# Altium schematic sheet LIDO-HW.100.OutputStage.SchDoc
size A3; SheetNumber: 9; SheetTotal: 17
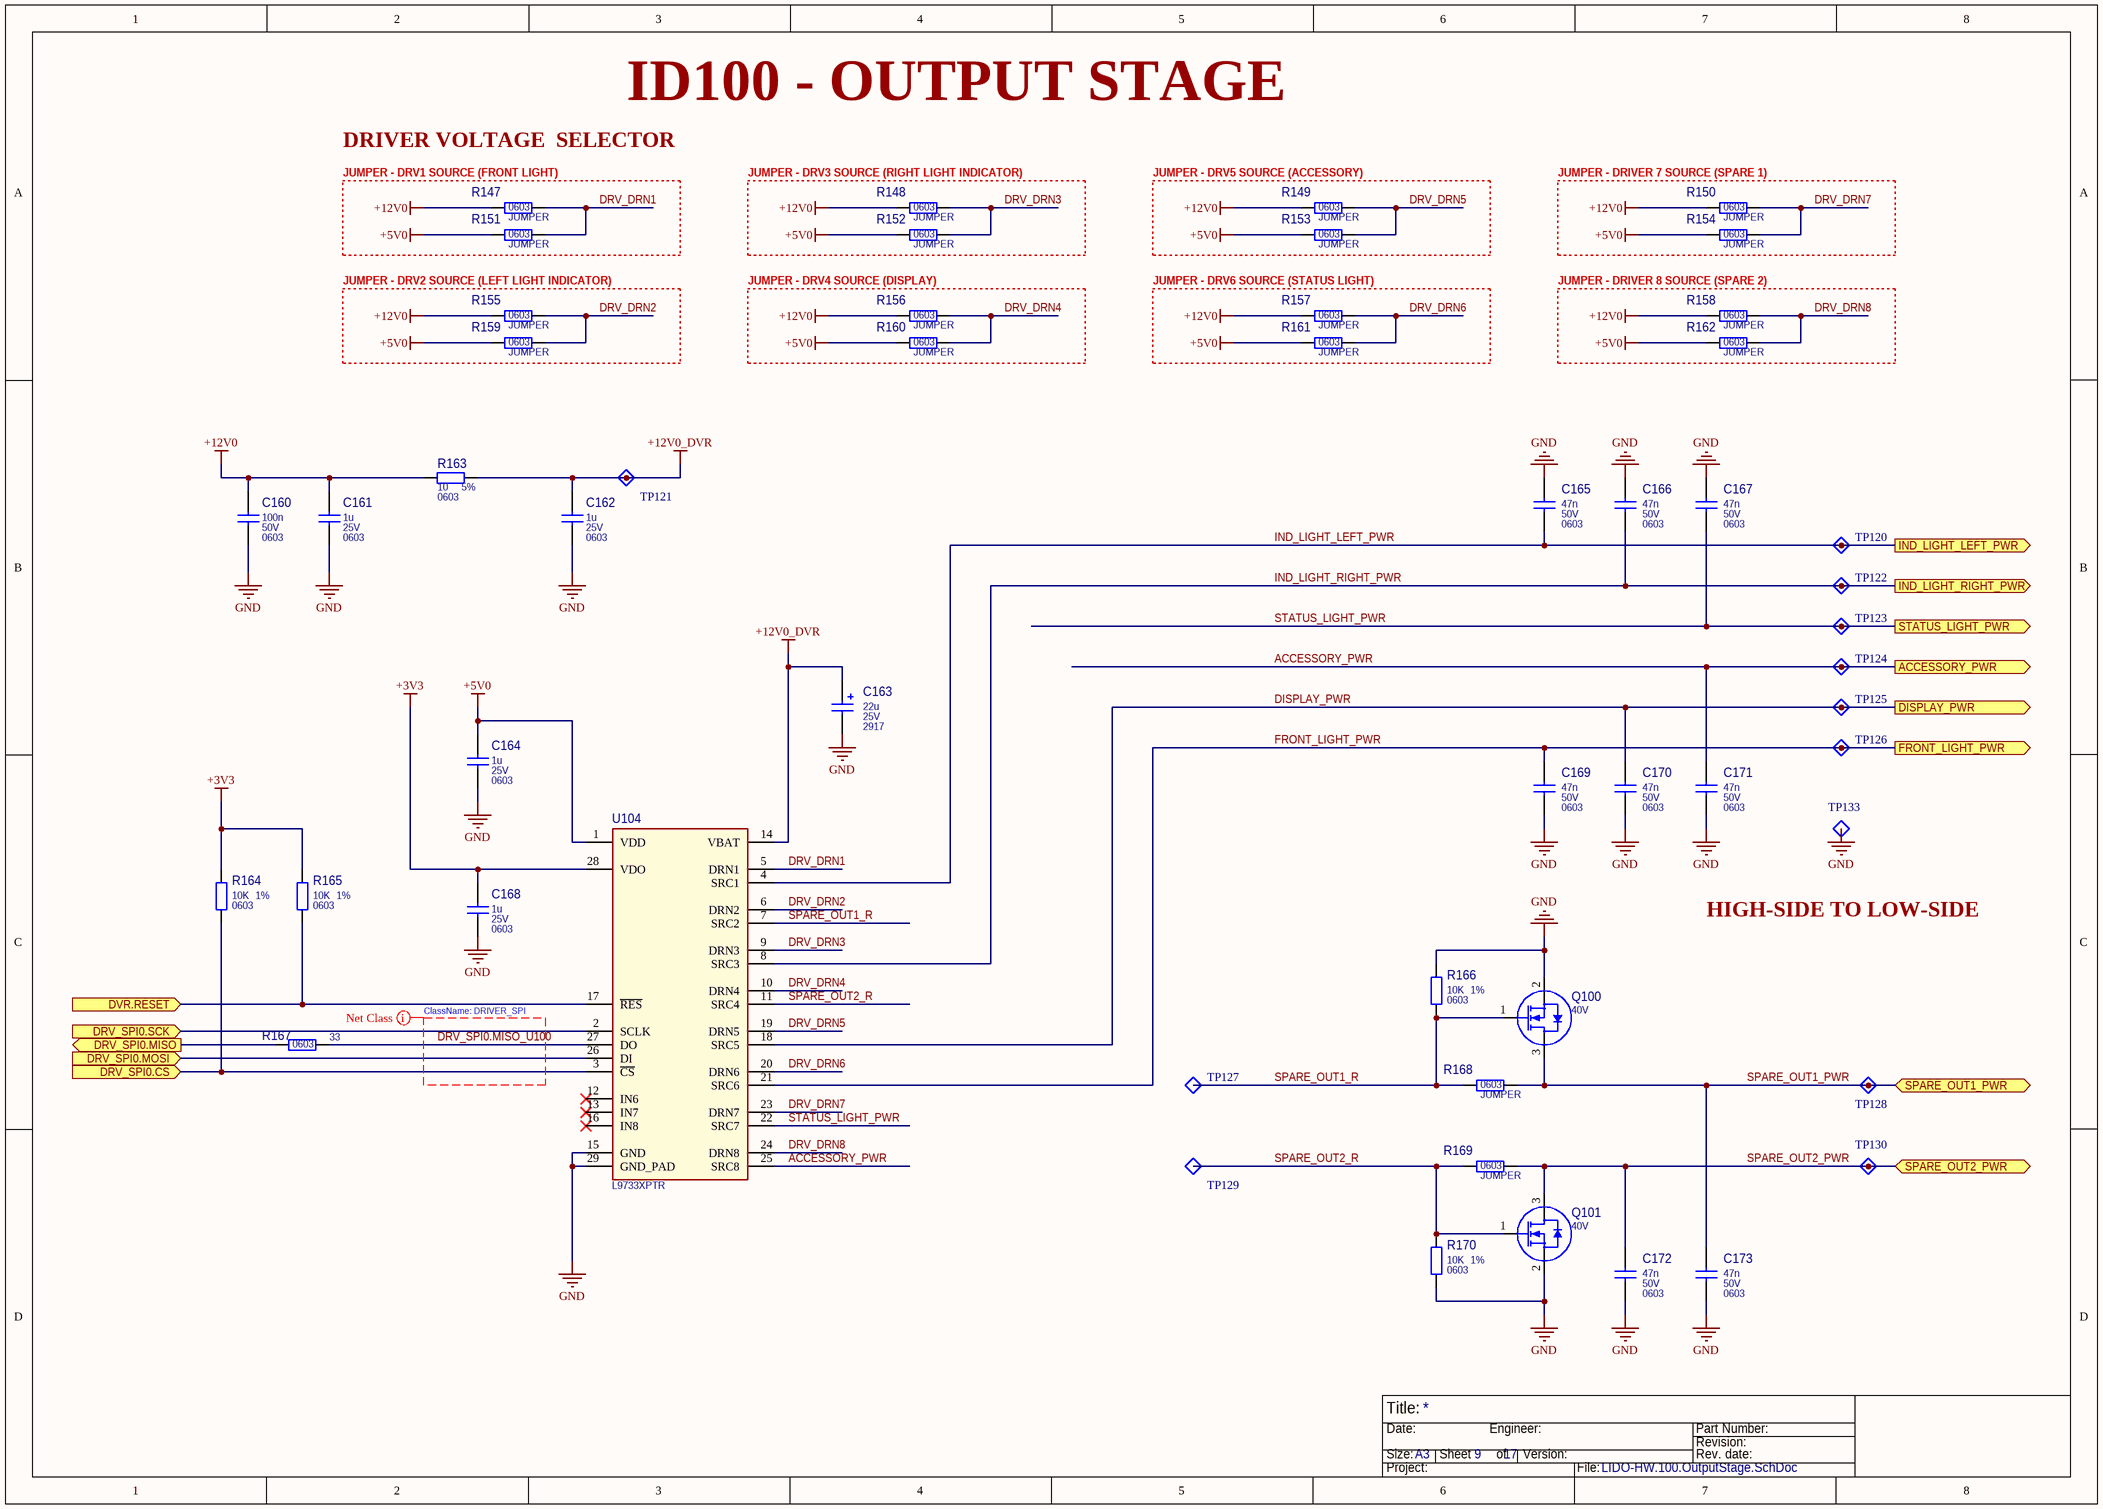
[diagram p0: LIDO-HW.100.OutputStage.SchDoc]

## Parts
C160  100n  Part Value 2: 50V  Part Package: 0603  [CAP_0603_1608X90-N_MURATA_A]
C161  1u  Part Value 2: 25V  Part Package: 0603  [CAP_0603_1608X90-N_MURATA_A]
C162  1u  Part Value 2: 25V  Part Package: 0603  [CAP_0603_1608X90-N_MURATA_A]
C163  22u  Part Value 2: 25V  Part Package: 2917  [CAP_2917_7343X140-N_MURATA_A]
C164  1u  Part Value 2: 25V  Part Package: 0603  [CAP_0603_1608X90-N_MURATA_A]
C165  47n  Part Value 2: 50V  Part Package: 0603  [CAP_0603_1608X90-N_MURATA_A]
C166  47n  Part Value 2: 50V  Part Package: 0603  [CAP_0603_1608X90-N_MURATA_A]
C167  47n  Part Value 2: 50V  Part Package: 0603  [CAP_0603_1608X90-N_MURATA_A]
C168  1u  Part Value 2: 25V  Part Package: 0603  [CAP_0603_1608X90-N_MURATA_A]
C169  47n  Part Value 2: 50V  Part Package: 0603  [CAP_0603_1608X90-N_MURATA_A]
C170  47n  Part Value 2: 50V  Part Package: 0603  [CAP_0603_1608X90-N_MURATA_A]
C171  47n  Part Value 2: 50V  Part Package: 0603  [CAP_0603_1608X90-N_MURATA_A]
C172  47n  Part Value 2: 50V  Part Package: 0603  [CAP_0603_1608X90-N_MURATA_A]
C173  47n  Part Value 2: 50V  Part Package: 0603  [CAP_0603_1608X90-N_MURATA_A]
Q100  40V  [SOT23-3P95_237X112L60-N_ANALOG_A]
Q101  40V  [SOT23-3P95_237X112L60-N_ANALOG_A]
R147  JUMPER  Part Package: 0603  [RES_0603_1608X60-N_YAGEO_A]
R148  JUMPER  Part Package: 0603  [RES_0603_1608X60-N_YAGEO_A]
R149  JUMPER  Part Package: 0603  [RES_0603_1608X60-N_YAGEO_A]
R150  JUMPER  Part Package: 0603  [RES_0603_1608X60-N_YAGEO_A]
R151  JUMPER  Part Package: 0603  [RES_0603_1608X60-N_YAGEO_A]
R152  JUMPER  Part Package: 0603  [RES_0603_1608X60-N_YAGEO_A]
R153  JUMPER  Part Package: 0603  [RES_0603_1608X60-N_YAGEO_A]
R154  JUMPER  Part Package: 0603  [RES_0603_1608X60-N_YAGEO_A]
R155  JUMPER  Part Package: 0603  [RES_0603_1608X60-N_YAGEO_A]
R156  JUMPER  Part Package: 0603  [RES_0603_1608X60-N_YAGEO_A]
R157  JUMPER  Part Package: 0603  [RES_0603_1608X60-N_YAGEO_A]
R158  JUMPER  Part Package: 0603  [RES_0603_1608X60-N_YAGEO_A]
R159  JUMPER  Part Package: 0603  [RES_0603_1608X60-N_YAGEO_A]
R160  JUMPER  Part Package: 0603  [RES_0603_1608X60-N_YAGEO_A]
R161  JUMPER  Part Package: 0603  [RES_0603_1608X60-N_YAGEO_A]
R162  JUMPER  Part Package: 0603  [RES_0603_1608X60-N_YAGEO_A]
R163  10  Part Value 2: 5%  Part Package: 0603  [RES_0603_1608X60-N_YAGEO_A]
R164  10K  Part Value 2: 1%  Part Package: 0603  [RES_0603_1608X60-N_YAGEO_A]
R165  10K  Part Value 2: 1%  Part Package: 0603  [RES_0603_1608X60-N_YAGEO_A]
R166  10K  Part Value 2: 1%  Part Package: 0603  [RES_0603_1608X60-N_YAGEO_A]
R167  33  Part Package: 0603  [RES_0603_1608X60-N_YAGEO_A]
R168  JUMPER  Part Package: 0603  [RES_0603_1608X60-N_YAGEO_A]
R169  JUMPER  Part Package: 0603  [RES_0603_1608X60-N_YAGEO_A]
R170  10K  Part Value 2: 1%  Part Package: 0603  [RES_0603_1608X60-N_YAGEO_A]
TP120  TestPoint_A  [TESTPOINT_1D_A]  (value not drawn)  (no BOM)
TP121  TestPoint_A  [TESTPOINT_1D_A]  (value not drawn)  (no BOM)
TP122  TestPoint_A  [TESTPOINT_1D_A]  (value not drawn)  (no BOM)
TP123  TestPoint_A  [TESTPOINT_1D_A]  (value not drawn)  (no BOM)
TP124  TestPoint_A  [TESTPOINT_1D_A]  (value not drawn)  (no BOM)
TP125  TestPoint_A  [TESTPOINT_1D_A]  (value not drawn)  (no BOM)
TP126  TestPoint_A  [TESTPOINT_1D_A]  (value not drawn)  (no BOM)
TP127  TestPoint_A  [TESTPOINT_1D_A]  (value not drawn)  (no BOM)
TP128  TestPoint_A  [TESTPOINT_1D_A]  (value not drawn)  (no BOM)
TP129  TestPoint_A  [TESTPOINT_1D_A]  (value not drawn)  (no BOM)
TP130  TestPoint_A  [TESTPOINT_1D_A]  (value not drawn)  (no BOM)
TP133  TestPoint_A  [TESTPOINT_1D_A]  (value not drawn)  (no BOM)
U104  L9733XPTR  [SSOP29P65_1030X1030X245L80X27-N_ST_A]

## Blocks framed on the sheet
JUMPER - DRV1 SOURCE (FRONT LIGHT): R147 R151
JUMPER - DRV3 SOURCE (RIGHT LIGHT INDICATOR): R148 R152
JUMPER - DRV5 SOURCE (ACCESSORY): R149 R153
JUMPER - DRIVER 7 SOURCE (SPARE 1): R150 R154
JUMPER - DRV2 SOURCE (LEFT LIGHT INDICATOR): R155 R159
JUMPER - DRV4 SOURCE (DISPLAY): R156 R160
JUMPER - DRV6 SOURCE (STATUS LIGHT): R157 R161
JUMPER - DRIVER 8 SOURCE (SPARE 2): R158 R162

## Ports
ACCESSORY_PWR (out), DISPLAY_PWR (out), DRV_SPI0.CS (in), DRV_SPI0.MISO (out), DRV_SPI0.MOSI (in), DRV_SPI0.SCK (in), DVR.RESET (in), FRONT_LIGHT_PWR (out), IND_LIGHT_LEFT_PWR (out), IND_LIGHT_RIGHT_PWR (out), SPARE_OUT1_PWR (bidir), SPARE_OUT2_PWR (bidir), STATUS_LIGHT_PWR (out)

## Nets
+3V3: C168.1 R164.2 R165.2 U104.28(VDO)
+5V0: C164.1 R151.1 R152.1 R153.1 R154.1 R159.1 R160.1 R161.1 R162.1 U104.1(VDD)
+12V0: C160.2 C161.1 R147.1 R148.1 R149.1 R150.1 R155.1 R156.1 R157.1 R158.1 R163.1
+12V0_DVR: C162.1 C163.1 R163.2 TP121.1(TP) U104.14(VBAT)
GND: C160.1 C161.2 C162.2 C163.2 C164.2 C165.1 C166.1 C167.1 C168.2 C169.2 C170.2 C171.2 C172.2 C173.2 Q100.2(S) Q101.2(S) R166.2 R170.1 TP133.1(TP) U104.15(GND) U104.29(GND_PAD)
ACCESSORY_PWR: C171.1 TP124.1(TP) U104.25(SRC8) ; port ACCESSORY_PWR
DISPLAY_PWR: C170.1 TP125.1(TP) U104.18(SRC5) ; port DISPLAY_PWR
DRV_DRN1: R147.2 R151.2 U104.5(DRN1)
DRV_DRN2: R155.2 R159.2 U104.6(DRN2)
DRV_DRN3: R148.2 R152.2 U104.9(DRN3)
DRV_DRN4: R156.2 R160.2 U104.10(DRN4)
DRV_DRN5: R149.2 R153.2 U104.19(DRN5)
DRV_DRN6: R157.2 R161.2 U104.20(DRN6)
DRV_DRN7: R150.2 R154.2 U104.23(DRN7)
DRV_DRN8: R158.2 R162.2 U104.24(DRN8)
DRV_SPI0.CS: R164.1 U104.3(~{CS}) ; port DRV_SPI0.CS
DRV_SPI0.MISO: R167.1 ; port DRV_SPI0.MISO
DRV_SPI0.MISO_U100: R167.2 U104.27(DO)
DRV_SPI0.MOSI: U104.26(DI) ; port DRV_SPI0.MOSI
DRV_SPI0.SCK: U104.2(SCLK) ; port DRV_SPI0.SCK
DVR.RESET: R165.1 U104.17(~{RES}) ; port DVR.RESET
FRONT_LIGHT_PWR: C169.1 TP126.1(TP) U104.21(SRC6) ; port FRONT_LIGHT_PWR
IND_LIGHT_LEFT_PWR: C165.2 TP120.1(TP) U104.4(SRC1) ; port IND_LIGHT_LEFT_PWR
IND_LIGHT_RIGHT_PWR: C166.2 TP122.1(TP) U104.8(SRC3) ; port IND_LIGHT_RIGHT_PWR
SPARE_OUT1_PWR: C173.1 Q100.3(D) R168.2 TP128.1(TP) ; port SPARE_OUT1_PWR
SPARE_OUT1_R: Q100.1(G) R166.1 R168.1 TP127.1(TP) U104.7(SRC2)
SPARE_OUT2_PWR: C172.1 Q101.3(D) R169.2 TP130.1(TP) ; port SPARE_OUT2_PWR
SPARE_OUT2_R: Q101.1(G) R169.1 R170.2 TP129.1(TP) U104.11(SRC4)
STATUS_LIGHT_PWR: C167.2 TP123.1(TP) U104.22(SRC7) ; port STATUS_LIGHT_PWR

Not connected (* = marked no-connect by the designer): U104 12(IN6)* 13(IN7)* 16(IN8)*

## Layout directives
net class DRIVER_SPI: DRV_SPI0.MISO_U100

## Notes on the sheet
- ID100 - OUTPUT STAGE
- DRIVER VOLTAGE  SELECTOR
- HIGH-SIDE TO LOW-SIDE
- ClassName: DRIVER_SPI
- Title:
- Size:
- Date:
- A3
- Sheet       of
- Engineer:
- Version:
- Part Number:
- Revision:
- Rev. date:
- Project:
- File:

## Library data of the parts
C160 = 77: CAP CER 0.1UF 50V X7R 0603; Manufacturer Part Number: CGA3E2X7R1H104K080AA; Manufacturer: TDK Corporation; Obsolete Part: False; Component ID: 77; Part Value: 100n; Part Value 3: X7R; Package Type: SMT
C161 C162 C164 C168 = 78: CAP CER 1UF 25V X7R 0603; Manufacturer Part Number: CGA3E1X7R1E105M080AE; Manufacturer: TDK Corporation; Obsolete Part: False; Component ID: 78; Part Value: 1u; Part Value 3: X7R; Package Type: SMT
C163 = 87: CAP ALUM POLY 22UF 20% 25V SMD; Manufacturer Part Number: ECASD31E226M040KA0; Manufacturer: Murata Electronics; Obsolete Part: False; Component ID: 87; Part Value: 22u; Part Value 3: 20%; Package Type: SMT
C165-C167 C169-C173 = 81: CAP CER 0.047UF 50V X7R 0603; Manufacturer Part Number: GCM188R71H473KA55D; Manufacturer: Murata Electronics; Manufacturer Part Number 2nd: CGA3E2X7R1H473M080AA; Manufacturer 2nd: TDK Corporation; Obsolete Part: False; Component ID: 81; Part Value: 47n; Part Value 3: X7R; Package Type: SMT
Q100 Q101 = 20: MOSFET N-CH 40V 4.6A SOT23; Manufacturer Part Number: DMN4035LQ-13; Manufacturer: Diodes Incorporated; Part Package: SOT23-3; Obsolete Part: False; Component ID: 20; Part Value: 40V; Part Value 2: 40V; Package Type: SMT
R147-R162 R168 R169 = 9: RES 0 OHM JUMPER 1/10W 0603; Manufacturer Part Number: RC0603JR-070RL; Manufacturer: YAGEO; Manufacturer Part Number 2nd: RMCF0603ZT0R00; Manufacturer 2nd: Stackpole Electronics Inc; Obsolete Part: False; Component ID: 9; Part Value: JUMPER; Part Value 2: 5%; Part Value 3: 1/10W; Package Type: SMT
R163 = 109: RES SMD 10 OHM 5% 1/4W 0603; Manufacturer Part Number: ESR03EZPJ100; Manufacturer: Rohm Semiconductor; Obsolete Part: False; Component ID: 109; Part Value: 10; Part Value 3: 1/10W; Package Type: SMT
R164-R166 R170 = 115: RES 10K OHM 1% 1/10W 0603; Manufacturer Part Number: RC0603FR-0710KL; Manufacturer: YAGEO; Obsolete Part: False; Component ID: 115; Part Value: 10K; Part Value 3: 1/10W; Package Type: SMT
R167 = 121: RES 33 OHM 5% 1/10W 0603; Manufacturer Part Number: RC0603JR-0733RL; Manufacturer: YAGEO; Obsolete Part: False; Component ID: 121; Part Value: 33; Part Value 2: 5%; Part Value 3: 1/10W; Package Type: SMT
TP120-TP130 TP133 = 3: Pad Diamater 1mm; Part: Test Point 1D A; Obsolete Part: False; 00_Name: TP_XXmm; Component ID: 3; 02_Layer: *; 01_Diameter: 1mm
U104 = 35: Power Switch/Driver 1:8 N-Channel 1A PowerSSO-28 Exposed Pad; Manufacturer: STMicroelectronics; Part Package: PSSOP-28; Obsolete Part: False; Component ID: 35; Manufacturer Part Number: L9733XPTR; Part Type: Power Switch; Package Type: SMT